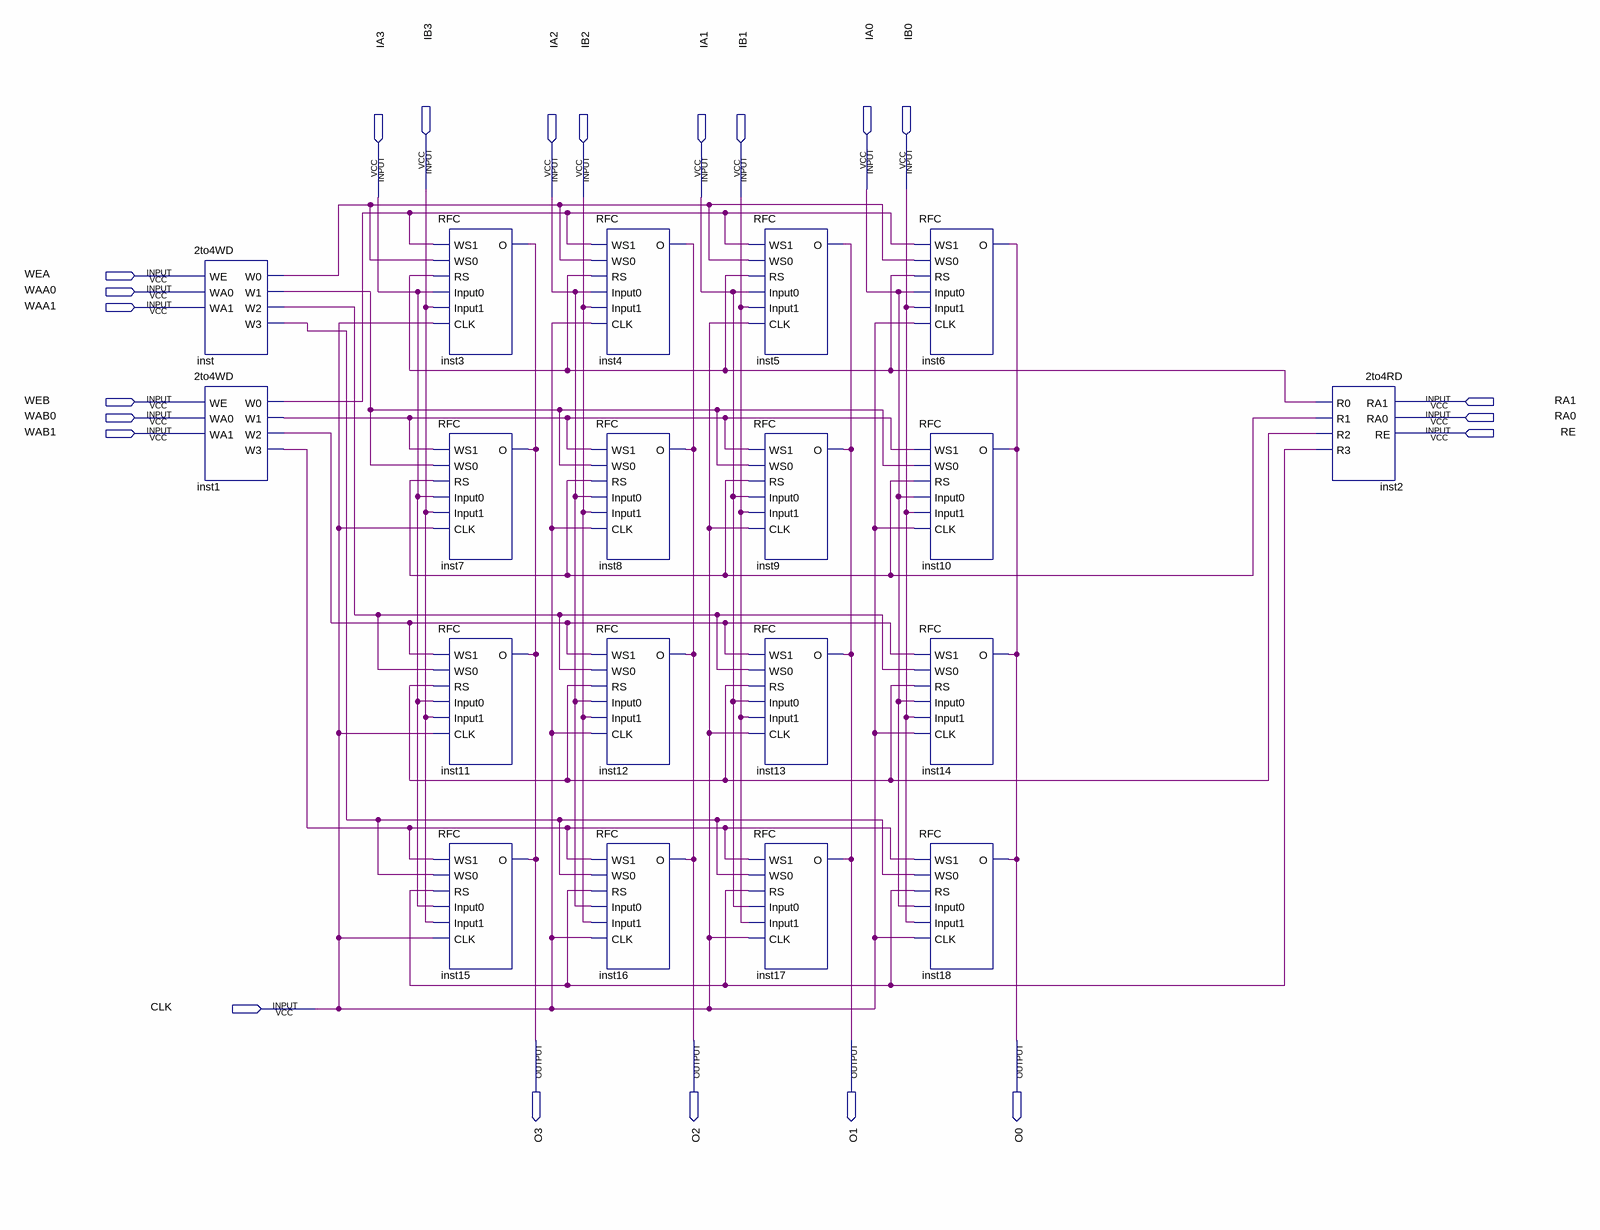
[diagram p0: schematic sheet]
// Quartus schematic 1R2W.bdf as structural Verilog: 19 symbols, 22 pins
module \1R2W  (
  input  IB3,
  input  IA0,
  input  IB0,
  input  IA3,
  input  IA2,
  input  IB2,
  input  IA1,
  input  IB1,
  input  WEA,
  input  WAA0,
  input  WAA1,
  input  WEB,
  input  RA1,
  input  WAB0,
  input  RA0,
  input  WAB1,
  input  RE,
  input  CLK,
  output O3,
  output O2,
  output O1,
  output O0
);

  wire inst1_w0, inst1_w1, inst1_w2, inst1_w3, inst2_r0, inst2_r1, inst2_r2, inst2_r3, inst_w0, inst_w1,
       inst_w2, inst_w3;

  \2to4WD  inst (.WE(WEA), .WA0(WAA0), .WA1(WAA1), .W0(inst_w0), .W1(inst_w1), .W2(inst_w2), .W3(inst_w3));
  \2to4WD  inst1 (.WE(WEB), .WA0(WAB0), .WA1(WAB1), .W0(inst1_w0), .W1(inst1_w1), .W2(inst1_w2), .W3(inst1_w3));
  RFC inst3 (.WS1(inst1_w0), .WS0(inst_w0), .RS(inst2_r0), .Input0(IA3), .Input1(IB3), .CLK(CLK), .O(O3));
  RFC inst7 (.WS1(inst1_w1), .WS0(inst_w1), .RS(inst2_r1), .Input0(IA3), .Input1(IB3), .CLK(CLK), .O(O3));
  RFC inst11 (.WS1(inst1_w2), .WS0(inst_w2), .RS(inst2_r2), .Input0(IA3), .Input1(IB3), .CLK(CLK), .O(O3));
  RFC inst15 (.WS1(inst1_w3), .WS0(inst_w3), .RS(inst2_r3), .Input0(IA3), .Input1(IB3), .CLK(CLK), .O(O3));
  RFC inst4 (.WS1(inst1_w0), .WS0(inst_w0), .RS(inst2_r0), .Input0(IA2), .Input1(IB2), .CLK(CLK), .O(O2));
  RFC inst8 (.WS1(inst1_w1), .WS0(inst_w1), .RS(inst2_r1), .Input0(IA2), .Input1(IB2), .CLK(CLK), .O(O2));
  RFC inst12 (.WS1(inst1_w2), .WS0(inst_w2), .RS(inst2_r2), .Input0(IA2), .Input1(IB2), .CLK(CLK), .O(O2));
  RFC inst16 (.WS1(inst1_w3), .WS0(inst_w3), .RS(inst2_r3), .Input0(IA2), .Input1(IB2), .CLK(CLK), .O(O2));
  RFC inst5 (.WS1(inst1_w0), .WS0(inst_w0), .RS(inst2_r0), .Input0(IA1), .Input1(IB1), .CLK(CLK), .O(O1));
  RFC inst9 (.WS1(inst1_w1), .WS0(inst_w1), .RS(inst2_r1), .Input0(IA1), .Input1(IB1), .CLK(CLK), .O(O1));
  RFC inst13 (.WS1(inst1_w2), .WS0(inst_w2), .RS(inst2_r2), .Input0(IA1), .Input1(IB1), .CLK(CLK), .O(O1));
  RFC inst17 (.WS1(inst1_w3), .WS0(inst_w3), .RS(inst2_r3), .Input0(IA1), .Input1(IB1), .CLK(CLK), .O(O1));
  RFC inst6 (.WS1(inst1_w0), .WS0(inst_w0), .RS(inst2_r0), .Input0(IA0), .Input1(IB0), .CLK(CLK), .O(O0));
  RFC inst10 (.WS1(inst1_w1), .WS0(inst_w1), .RS(inst2_r1), .Input0(IA0), .Input1(IB0), .CLK(CLK), .O(O0));
  RFC inst14 (.WS1(inst1_w2), .WS0(inst_w2), .RS(inst2_r2), .Input0(IA0), .Input1(IB0), .CLK(CLK), .O(O0));
  RFC inst18 (.WS1(inst1_w3), .WS0(inst_w3), .RS(inst2_r3), .Input0(IA0), .Input1(IB0), .CLK(CLK), .O(O0));
  \2to4RD  inst2 (.RA1(RA1), .RA0(RA0), .RE(RE), .R0(inst2_r0), .R1(inst2_r1), .R2(inst2_r2), .R3(inst2_r3));
endmodule
